# Altium project Vreg_Learning_Platform_Version1.0.PrjPcb (part 2 of 6)

## Sheet Input.SchDoc: <Project Name>
size A3; ApprovedBy: <Appr.>; Author: <Author>; CompanyName: Infineon Technologies AG; Engineer: <Rel.>; Organization: Infineon Technologies AG; Address1: IFAG DES S PS; Address2: Am Campeon 1-12  -  85579 Neubiberg  -  Germany; Address3: 85579 Neubiberg; Address4: Germany; DocumentNumber: 3; Revision: <Rev.>; SheetNumber: 3; SheetTotal: 9; Release: RC00; PageSetup: Record=PageOptions|CenterHorizontal=True|CenterVertical=True|PrintScale=1.01|XCorrection=1.00|YCorrection=1.00|PrintKind=0|BorderSize=5000000|LeftOffset=0|BottomOffset=0|Orientation=2|PaperLength=1000|PaperWidth=1000|Scale=100|PaperSource=7|PrintQuality=-4|MediaType=1|DitherType=10|PaperKind=A3|PrintScaleMode=1; Doc_ConfidentialStatus: <Doc_ConfidentialStatus>; Doc_Preliminary: <Doc_Preliminary>
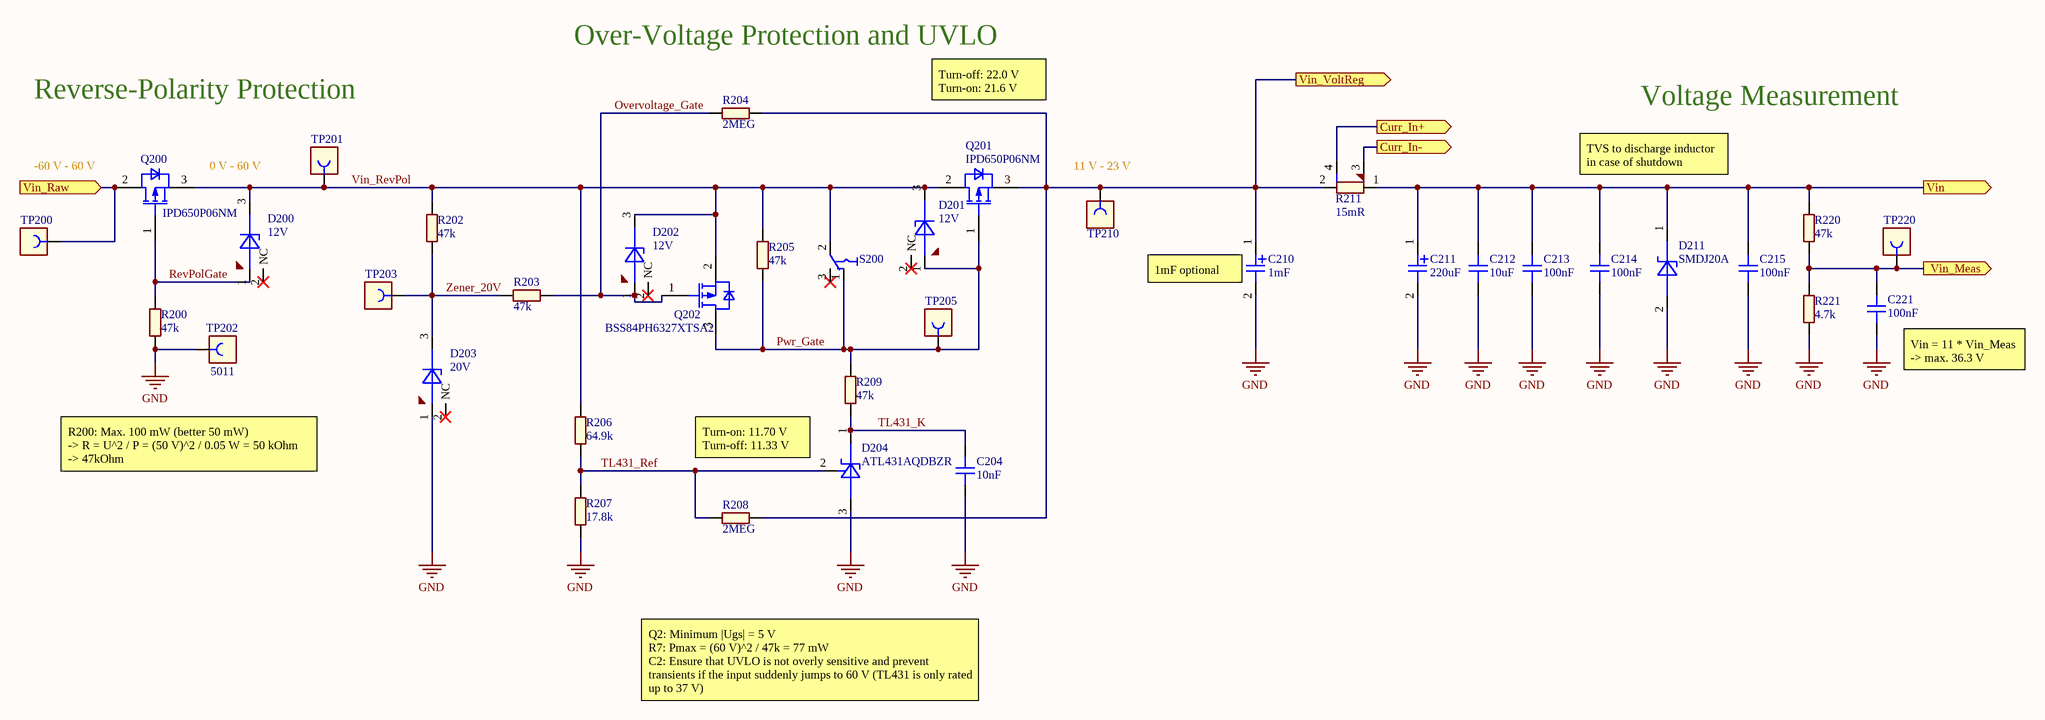
[diagram p1: Input.SchDoc]

### Parts
C204  10nF  [CAPC1608X90N-4]
C210  1mF  [CAPPRD500W60D1300H2700B]
C211  220uF  [CAPAE1030X1050N-2]
C212  10uF  [CAPC3216X190N-1]
C213  100nF  [CAPC1608X90N-2]
C214  100nF  [CAPC1608X90N-2]
C215  100nF  [CAPC1608X90N-2]
C221  100nF  [CAPC1608X90N-2]
D200  12V  [SOT95P237X111-3N-1]
D201  12V  [SOT95P237X111-3N-1]
D202  12V  [SOT95P237X111-3N-1]
D203  20V  [SOT95P237X111-3N-1]
D204  ATL431AQDBZR  [SOT95P237X112-3N-1]
D211  SMDJ20A  [DIOM7959X262N]
Q200  IPD650P06NM  [TO228P998X250-3N-V2]
Q201  IPD650P06NM  [TO228P998X250-3N-V2]
Q202  BSS84PH6327XTSA2  [SOT95P240X110-3N-1]
R200  47k  [RESC1609X50N]
R202  47k  [RESC1609X50N]
R203  47k  [RESC1609X50N]
R204  2MEG  [RESC1609X50N]
R205  47k  [RESC1609X50N]
R206  64.9k  [RESC1609X50N]
R207  17.8k  [RESC1609X50N]
R208  2MEG  [RESC1609X50N]
R209  47k  [RESC1609X50N]
R211  15mR  [RES-SMD-L4T12]
R220  47k  [RESC1609X50N]
R221  4.7k  [RESC1609X50N]
S200  CL-SB-12A-01T  [SW-SMD-CL-SB-12A-01T]  (value not drawn)
TP200  S1751-46R  [CON-SMD-TT-S1751-46]  (value not drawn)
TP201  S1751-46R  [CON-SMD-TT-S1751-46]  (value not drawn)
TP202  5011  [CON-THT-TP-5011]
TP203  S1751-46R  [CON-SMD-TT-S1751-46]  (value not drawn)
TP205  S1751-46R  [CON-SMD-TT-S1751-46]  (value not drawn)
TP210  S1751-46R  [CON-SMD-TT-S1751-46]  (value not drawn)
TP220  S1751-46R  [CON-SMD-TT-S1751-46]  (value not drawn)

### Ports
Curr_In+ (out), Curr_In- (out), Vin (out), Vin_Meas (out), Vin_Raw (in), Vin_VoltReg (out)

### Nets
GND: C204.1 C210.2 C211.2 C212.1 C213.1 C214.1 C215.1 C221.1 D203.1(ANODE) D204.3(ANODE) D211.2(ANODE) R200.1 R207.1 R221.1 TP202.1
Curr_In+: R211.4(I2) ; port Curr_In+
Curr_In-: R211.3(I1) ; port Curr_In-
Overvoltage_Gate: D202.1(ANODE) Q202.1(GATE) R203.1 R204.1
Pwr_Gate: D201.1(ANODE) Q201.1(GATE) Q202.3(DRAIN) R205.1 R209.2 S200.1 TP205.1
RevPolGate: D200.1(ANODE) Q200.1(GATE) R200.2
TL431_K: C204.2 D204.1(CATHODE) R209.1
TL431_Ref: D204.2(REF) R206.1 R207.2 R208.1
Vin: C211.1 C212.2 C213.2 C214.2 C215.2 D211.1(CATHODE) R211.1(V1) R220.1 ; port Vin
Vin_Meas: C221.2 R220.2 R221.2 TP220.1 ; port Vin_Meas
Vin_Raw: Q200.2(DRAIN) TP200.1 ; port Vin_Raw
Vin_RevPol: D200.3(CATHODE) D201.3(CATHODE) D202.3(CATHODE) Q200.3(SOURCE) Q201.2(DRAIN) Q202.2(SOURCE) R202.2 R205.2 R206.2 S200.2 TP201.1
Vin_VoltReg: C210.1 Q201.3(SOURCE) R204.2 R208.2 R211.2(V2) TP210.1 ; port Vin_VoltReg
Zener_20V: D203.3(CATHODE) R202.1 R203.2 TP203.1

Not connected (* = marked no-connect by the designer): D200 2(NC)*; D201 2(NC)*; D202 2(NC)*; D203 2(NC)*; S200 3*

### Notes on the sheet
- Over-Voltage Protection and UVLO
- Reverse-Polarity Protection
- Turn-off: 22.0 V
  Turn-on: 21.6 V
- Voltage Measurement
- (near Q200) -60 V - 60 V
- 0 V - 60 V
- (near TP210) 11 V - 23 V
- TVS to discharge inductor in case of shutdown
- (near C210) 1mF optional
- (near C221) Vin = 11 * Vin_Meas
  -> max. 36.3 V
- R200: Max. 100 mW (better 50 mW)
  -> R = U^2 / P = (50 V)^2 / 0.05 W = 50 kOhm
  -> 47kOhm
- Turn-on: 11.70 V
  Turn-off: 11.33 V
- Q2: Minimum |Ugs| = 5 V
  R7: Pmax = (60 V)^2 / 47k = 77 mW
  C2: Ensure that UVLO is not overly sensitive and prevent transients if the input suddenly jumps to 60 V (TL431 is only rated up to 37 V)
- Title
- Variant
- Approved
- Date:
- Author:
- Size:
- A3
- Document Name
- Time:
- SVN Revision:
- Rel.
- Rev.
- Sheet
- of

### Library data of the parts
C204 = 309974: CAP / CERA / 10nF / 50V / 10% / X8R (EIA) / -55°C to 150°C / 0603(1608) / SMD / -; Multiple Parts: No; Legacy PartNumber: CAP01010834; Manufacturer: TDK Corporation; Manufacturer Order Number: C1608X8R1H103K080AA; Symbol Type: Capacitor; Single; Standard; 2 Pins; Alternate View: Yes; Article Number: 309974; Version Number: V01; Combined Parameters: TC:X8R (EIA);Tol.:-10%/+10%;Vdc:50V; QuickPick: 10nF / 50V / 10% / X8R (EIA) / 0603 (1608); Type: Standard; Style: Single; Package Metric: 1608; Package Imperial: 0603; ComponentStatus: Released; PLMStatus: Active; Legacy DeviceID: CAP01010834; Part Type: Capacitor; Value: 10nF; Tolerance Neg: 10%; Tolerance Pos: 10%; Technology: Ceramic; Temperature min: -55; Temperature max: 150; Temperature Range: Military; ROHS Compliant: Y; Automotive Qualified: No; PackageReference: 0603 (1608); ComponentLink1Description: Vendor WebSite; ComponentLink1URL: http://www.tdk.com; ComponentLink2Description: Datasheet; ComponentLink2URL: http://webnetprod.muc.infineon.com/PCBPortal_Prod/WorkFlows/AltiumComponent/StandardDocumentation?Versionid=309975; Supplier 1: Farnell; Supplier Part Number 1: 1844454; Supplier 2: DigiKey; Supplier Part Number 2: 445-2504-2-ND; Supplier 3: Mouser; Supplier Part Number 3: 810-C1608X8R1H103K; Second Source allowed: Yes; Voltage DC (max): 50V; Package Description: Capacitor,non-polarized,Chip;1.60mm L X 0.80mm W X 0.90mm H
C210 = 646789: CAP / ELCO / 1mF / 35V / 20% / Aluminiumelectrolytic / -40°C to 105°C / 5.00mm C X 0.60mm W 13.00mm Dia X 27.00mm H / - / -; Multible Parts: No; Manufacturer: Kemet; Manufacturer Order Number: ESY108M035AL4AA; Symbol Type: Capacitor; Single; Polarized; 2 Pins; Pin 1 Positive; Alternate View: Yes; Article Number: 646789; Version Number: V01; Combined Parameters: TC:Aluminiumelectrolytic;Tol.:-20%/+20%;Vdc:35V; QuickPick: 1mF / 35V / 20% / Aluminiumelectrolytic / Radial; Type: Polarized; Style: Single; ComponentStatus: Released; PLMStatus: Active; Part Type: Capacitor; Value: 1mF; Tolerance Neg: 20%; Tolerance Pos: 20%; Application: Standard; Technology: Electrolytic; Temperature min: -40; Temperature max: 105; Temperature Range: Industrial; ROHS Compliant: Y; Automotive Qualified: No; PackageReference: Radial; ComponentLink1Description: Vendor WebSite; ComponentLink1URL: http://www.kemet.com; ComponentLink2Description: Datasheet; ComponentLink2URL: http://webnetprod.muc.infineon.com/PCBPortal_Prod/WorkFlows/AltiumComponent/StandardDocumentation?Versionid=646790; Supplier 1: Farnell; Supplier Part Number 1: 2835188; Supplier 2: DigiKey; Supplier Part Number 2: 399-6120-ND; Supplier 3: Mouser; Supplier Part Number 3: 80-ESY108M035AL4AA; Second Source allowed: Yes; Voltage DC (max): 35V; Package Description: Capacitor,polarized,Radial;5.00mm C X 0.60mm W 13.00mm Dia X 27.00mm H
C211 = 646791: CAP / ELCO / 220uF / 50V / 20% / Aluminiumelectrolytic / -55°C to 105°C / 10.30mm L X 10.30mm W X 10.50mm H / SMD / -; Multible Parts: No; Manufacturer: Wurth Elektronik; Manufacturer Order Number: 865080657018; Symbol Type: Capacitor; Single; Polarized; 2 Pins; Pin 1 Positive; Alternate View: Yes; Article Number: 646791; Version Number: V01; Combined Parameters: TC:Aluminiumelectrolytic;Tol.:-20%/+20%;Vdc:50V; QuickPick: 220uF / 50V / 20% / Aluminiumelectrolytic / SMD; Type: Polarized; Style: Single; ComponentStatus: Released; PLMStatus: Active; Part Type: Capacitor; Value: 220uF; Tolerance Neg: 20%; Tolerance Pos: 20%; Application: Standard; Technology: Electrolytic; Temperature min: -55; Temperature max: 105; Temperature Range: Military; ROHS Compliant: Y; Automotive Qualified: No; PackageReference: SMD; ComponentLink1Description: Vendor WebSite; ComponentLink1URL: http://www.we-online.com; ComponentLink2Description: Datasheet; ComponentLink2URL: http://webnetprod.muc.infineon.com/PCBPortal_Prod/WorkFlows/AltiumComponent/StandardDocumentation?Versionid=646792; Supplier 1: Farnell; Supplier Part Number 1: 2466345; Supplier 2: DigiKey; Supplier Part Number 2: 732-8463-1-ND; Supplier 3: Mouser; Supplier Part Number 3: 710-865080657018; Second Source allowed: Yes; Voltage DC (max): 50V; Package Description: Capacitor,Aluminum Electrolytic;10.30mm L X 10.30mm W X 10.50mm H
C212 = 648992: CAP / CERA / 10uF / 50V / 20% / X5R (EIA) / -55°C to 85°C / 1206 (3216) / SMD / -; Multiple Parts: No; Manufacturer: Taiyo Yuden; Manufacturer Order Number: UMK316BBJ106ML-T; Symbol Type: Capacitor; Single; Standard; 2 Pins; Alternate View: Yes; Article Number: 648992; Version Number: V00; Combined Parameters: TC:X5R (EIA);Tol.:-20%/+20%;Vdc:50V; QuickPick: 10uF / 50V / 20% / X5R (EIA) / 1206 (3216); Type: Standard; Style: Single; ComponentStatus: Released; PLMStatus: Active; Part Type: Capacitor; Value: 10uF; Tolerance Neg: 20%; Tolerance Pos: 20%; Application: Standard; Technology: Ceramic; Temperature min: -55; Temperature max: 85; Temperature Range: Military; ROHS Compliant: Y; Automotive Qualified: No; PackageReference: 1206 (3216); ComponentLink1Description: Vendor WebSite; ComponentLink1URL: http://www.yuden.co.jp/or/product/; ComponentLink2Description: Datasheet; ComponentLink2URL: http://webnetprod.muc.infineon.com/PCBPortal_Prod/WorkFlows/AltiumComponent/StandardDocumentation?Versionid=648993; Supplier 1: Farnell; Supplier Part Number 1: 2779059; Supplier 2: DigiKey; Supplier Part Number 2: 587-3248-1-ND; Supplier 3: Mouser; Supplier Part Number 3: 963-UMK316BBJ106ML-T; Second Source allowed: Yes; Voltage DC (max): 50V; Package Description: Capacitor,non-polarized,Chip;3.20mm L X 1.60mm W X 1.90mm H
C213-C215 C221 = 479045: CAP / CERA / 100nF / 50V / 10% / X7R (EIA) / -55°C to 125°C / 0603 / SMD / -; Multiple Parts: No; Manufacturer: AVX; Manufacturer Order Number: 06035C104KAT2A; Symbol Type: Capacitor; Single; Standard; 2 Pins; Alternate View: Yes; Article Number: 479045; Version Number: V01; Combined Parameters: TC:X7R (EIA);Tol.:-10%/+10%;Vdc:50V; QuickPick: 100nF / 50V / 10% / X7R (EIA) / 0603; Type: Standard; Style: Single; ComponentStatus: Released; PLMStatus: Active; Part Type: Capacitor; Value: 100nF; Tolerance Neg: 10%; Tolerance Pos: 10%; Application: Standard; Technology: Ceramic; Temperature min: -55; Temperature max: 125; Temperature Range: Military; ROHS Compliant: Y; Automotive Qualified: No; PackageReference: 0603; ComponentLink1Description: Vendor WebSite; ComponentLink1URL: http://www.avx.com; ComponentLink2Description: Datasheet; ComponentLink2URL: http://webnetprod.muc.infineon.com/PCBPortal_Prod/WorkFlows/AltiumComponent/StandardDocumentation?Versionid=479046; Supplier 1: Farnell; Supplier Part Number 1: 2280883; Supplier 2: DigiKey; Supplier Part Number 2: 478-5052-2-ND; Supplier 3: Mouser; Supplier Part Number 3: 581-06035C104KAT2A; Second Source allowed: Yes; Voltage DC (max): 50V; Package Description: Capacitor,non-polarized,Chip;1.60mm L X 0.81mm W X 0.90mm H
D200-D202 = 391041: Zener Voltage Regulator, 250 mW, 12V; Multiple Parts: No; Manufacturer: ON Semiconductor; Manufacturer Order Number: BZX84C12LT1G; Symbol Type: Standard Zener Diode, 3 Pins, 1 Anode, 2 Not Connected, 3 Cathode; Alternate View: Yes; Article Number: 391041; Version Number: V01; Combined Parameters: Vf:900mV;If:10mA;Ur:8V;Ir:100nA;Pmax:250mW; QuickPick: Zener Diode / SOT-23(TO-236); Type: Zener Diode; Style: Single; ComponentStatus: Released; PLMStatus: Active; Voltage DC (max): na; Part Type: Diode; Value: 12V; Application: Standard; Temperature min: -65; Temperature max: 150; Temperature Range: Military; ROHS Compliant: Y; Automotive Qualified: No; PackageReference: SOT-23(TO-236); ComponentLink1Description: Vendor WebSite; ComponentLink1URL: http://onsemi.com/; ComponentLink2Description: Datasheet; ComponentLink2URL: http://webnetprod.muc.infineon.com/PCBPortal_Prod/WorkFlows/AltiumComponent/StandardDocumentation?Versionid=391042; Supplier 1: Farnell; Supplier Part Number 1: 1459049; Supplier 2: DigiKey; Supplier Part Number 2: BZX84C12LT1GOSCT-ND; Supplier 3: Mouser; Supplier Part Number 3: 863-BZX84C12LT1G; Second Source allowed: Yes; Package Description: SOT,0.95mm pitch;3 pin,1.30mm W X 2.92mm L X 1.11mm H body
D203 = 391066: Zener Voltage Regulators; Multiple Parts: No; Manufacturer: ON Semiconductor; Manufacturer Order Number: BZX84C20LT1G; Symbol Type: Standard Zener Diode, 3 Pins, 1 Anode, 2 Not Connected, 3 Cathode; Alternate View: Yes; Article Number: 391066; Version Number: V01; Combined Parameters: Vf:900mV;If:10mA;Ur:14V;Ir:50nA;Pmax:250mW; QuickPick: Zener Diode / SOT-23; Type: Zener Diode; Style: Single; ComponentStatus: Released; PLMStatus: Active; Voltage DC (max): na; Part Type: Diode; Value: 20V; Application: Power Electronics; Temperature min: -65; Temperature max: 105; Temperature Range: Military; ROHS Compliant: Y; Automotive Qualified: No; PackageReference: SOT-23; ComponentLink1Description: Vendor WebSite; ComponentLink1URL: http://onsemi.com/; ComponentLink2Description: Datasheet; ComponentLink2URL: http://webnetprod.muc.infineon.com/PCBPortal_Prod/WorkFlows/AltiumComponent/StandardDocumentation?Versionid=391067; Supplier 1: Farnell; Supplier Part Number 1: 2463492; Supplier 2: DigiKey; Supplier Part Number 2: BZX84C20LT1GOSCT-ND; Supplier 3: Mouser; Supplier Part Number 3: 863-BZX84C20LT1G; Second Source allowed: Yes; Package Description: SOT,0.95mm pitch;3 pin,1.30mm W X 2.92mm L X 1.11mm H body
D204 = 644060: ATL431 Adjustable Precision Shunt Regulator; Manufacturer: Texas Instruments; Symbol type: TVS Diode Symbol, 1 Cathode, 2 Reference , 3 Anode; Article Number: 644060; Version Number: V01; Legacy DeviceID: TI_ATL431AQDBZR; Combined Parameters: - -;Vdc min/max:-;Iout:-;Fmax:-; QuickPick: SOT23-3 (DBZ); Automotive Qualified: No; ComponentStatus: Released; PLMStatus: Active; Second Source allowed: Yes; Voltage DC (max): na; Part Type: Integrated Circuit; Manufacturer Order Number: ATL431AQDBZR; Value: ATL431AQDBZR; Temperature min: -40; Temperature max: 125; Temperature Range: Automotive; ROHS Compliant: Y; PackageReference: SOT23-3 (DBZ); ComponentLink1Description: Vendor WebSite; ComponentLink1URL: http://www.ti.com; ComponentLink2Description: Datasheet; ComponentLink2URL: http://webnetprod.muc.infineon.com/PCBPortal_Prod/WorkFlows/AltiumComponent/StandardDocumentation?Versionid=644061; Supplier 1: Farnell; Supplier 2: DigiKey; Supplier Part Number 2: 296-47201-1-ND; Supplier 3: Mouser; Supplier Part Number 3: 595-ATL431AQDBZR; Package Description: SOT,0.95mm pitch;3 pin,1.30mm W X 2.92mm L X 1.12mm H body
D211 = 646382: TVS Diode, Low Profile Package, Built in Strain Relief, Glass Passivated Chip Junction; Manufacturer: Littelfuse; Symbol Type: Transient Voltage Suppressor Diode (TVS, TAZ), 1 Cathode, 2 Anode; Article Number: 646382; Version Number: V01; Combined Parameters: Vf:5V;If:-;Ur:20V;Ir:2uA;Pmax:6.5W; QuickPick: TVS Diode / DO-214AB; Style: Single; Automotive Qualified: No; ComponentStatus: Released; PLMStatus: Active; Second Source allowed: Yes; Voltage DC (max): na; Part Type: Diode; Manufacturer Order Number: SMDJ20A; Value: SMDJ20A; Type: TVS Diode; Application: Standard; Temperature min: -65; Temperature max: 150; Temperature Range: Military; ROHS Compliant: Y; PackageReference: DO-214AB; ComponentLink1Description: Vendor WebSite; ComponentLink1URL: http://www.littelfuse.com/; ComponentLink2Description: Datasheet; ComponentLink2URL: http://webnetprod.muc.infineon.com/PCBPortal_Prod/WorkFlows/AltiumComponent/StandardDocumentation?Versionid=646383; Supplier 1: Farnell; Supplier Part Number 1: 2777300; Supplier 2: DigiKey; Supplier Part Number 2: SMDJ20ACT-ND; Supplier 3: Mouser; Supplier Part Number 3: 576-SMDJ20A; Package Description: Diode,Molded Body;7.94mm L X 5.905mm W X 2.62mm H
Q200 Q201 = 644075: OptiMOS Power Transistor, -60 V; Manufacturer: Infineon Technologies; Symbol Type: Insulated-Gate Field-Effect Transistor (IGFET), P-Channel, Enhancement,  Body Diode, Pin 1 Gate, 2 Drain, 3 Source, 3 Pins; Article Number: 644075; Version Number: V01; Legacy DeviceID: IFX_IPD650P06NM; Combined Parameters: P-Channel Enhancement;Uds:-60V;Id:-22A;Rds:65R;P:83W; QuickPick: P-Channel Enhancement / 83W / -22A / -60V / PG-TO252-3-313; Type: P-Channel Enhancement; Style: Single; Automotive Qualified: No; ComponentStatus: Released; PLMStatus: Active; Second Source allowed: Yes; Voltage DC (max): na; Part Type: Transistor FET; Manufacturer Order Number: IPD650P06NM; Value: IPD650P06NM; Application: Power Electronics; Temperature min: -55; Temperature max: 175; Temperature Range: Military; ROHS Compliant: Y; PackageReference: PG-TO252-3-313; ComponentLink1Description: Vendor WebSite; ComponentLink1URL: https://www.infineon.com/; ComponentLink2Description: Datasheet; ComponentLink2URL: http://webnetprod.muc.infineon.com/PCBPortal_Prod/WorkFlows/AltiumComponent/StandardDocumentation?Versionid=644076; Supplier 1: Farnell; Supplier Part Number 1: 3267848; Supplier 2: DigiKey; Supplier Part Number 2: 448-IPD650P06NMATMA1CT-ND; Supplier 3: Mouser; Supplier Part Number 3: 726-IPD650P06NMATMA1; Package Description: TO,2.28mm pitch;2 pin,9.98mm L X 6.50mm W X 2.50mm H body
Q202 = 422992: SIPMOS P-Channel Enhancement Small-Signal-Transistor; Legacy PartNumber: IFX01400461; Manufacturer: Infineon Technologies; Symbol Type: Insulated-Gate Field-Effect Transistor (IGFET), P-Channel, Enhancement,  Body Diode, Pin 1 Gate, 2 Source, 3 Drain, 3 Pins; Article Number: 422992; Version Number: V01; Legacy DeviceID: IFX_BSS84PH6327XTSA2; Combined Parameters: P-Channel;Uds:-60V;Id:-170mA;Rds:12R;P:360mW; QuickPick: P-Channel / 360mW / -170mA / -60V / PG-SOT23; Style: Single; Automotive Qualified: AEC Q101; ComponentStatus: Released; PLMStatus: Active; Second Source allowed: Yes; Voltage DC (max): na; Part Type: Transistor FET; Manufacturer Order Number: BSS84PH6327XTSA2; Value: BSS84PH6327XTSA2; Type: P-Channel; Application: Power Supply; Temperature min: -55; Temperature max: 150; Temperature Range: Military; ROHS Compliant: Y; PackageReference: PG-SOT23; ComponentLink1Description: Vendor WebSite; ComponentLink1URL: https://www.infineon.com/; ComponentLink2Description: Datasheet; ComponentLink2URL: http://webnetprod.muc.infineon.com/PCBPortal_Prod/WorkFlows/AltiumComponent/StandardDocumentation?Versionid=422993; Supplier 1: Farnell; Supplier Part Number 1: 1056526; Supplier 2: DigiKey; Supplier Part Number 2: BSS84PH6327XTSA2TR-ND; Supplier 3: Mouser; Supplier Part Number 3: 726-BSS84PH6327XTSA2; Package Description: SOT23, 3-Leads, Body 2.90x2.40mm, Pitch 0.95mm, IPC Medium Density
R200 R202 R203 R205 R209 R220 = 346552: RES / STD / 47k / 100mW / 1% / 100ppm/K / -55°C to 155°C / 0603 / SMD / -; Multiple Parts: No; Legacy PartNumber: RES01801333; Manufacturer: Vishay; Manufacturer Order Number: CRCW060347K0FK; Symbol Type: Resistor; Single; Standard; 2 Pins; Alternate View: Yes; Article Number: 346552; Version Number: V01; Combined Parameters: TCR:100ppm/K;Tol.:-1%/+1%;Vdc:75V;Idc:-;P:100mW; QuickPick: 47k / 1% / 0.1 / 0603; Style: Single; Automotive Qualified: AEC Q200; ComponentStatus: Released; PLMStatus: Active; Voltage DC (max): 75V; Legacy DeviceID: RES01801333; Part Type: Resistor; Value: 47k; Tolerance Neg: 1%; Tolerance Pos: 1%; Type: Standard; Technology: Thick Film; Temperature min: -55; Temperature max: 155; Temperature Range: Military; ROHS Compliant: Y; PackageReference: 0603; ComponentLink1Description: Vendor WebSite; ComponentLink1URL: http://www.vishay.com; ComponentLink2Description: Datasheet; ComponentLink2URL: http://webnetprod.muc.infineon.com/PCBPortal_Prod/WorkFlows/AltiumComponent/StandardDocumentation?Versionid=346553; Supplier 1: Farnell; Supplier 2: DigiKey; Supplier Part Number 2: 541-47.0KHCT-ND; Supplier 3: Mouser; Second Source allowed: Yes
R204 R208 = 347472: RES / STD / 2MEG / 100mW / 1% / 100ppm/K / -55°C to 155°C / 0603 / SMD / -; Multiple Parts: No; Legacy PartNumber: RES01801517; Manufacturer: Vishay; Manufacturer Order Number: CRCW06032M00FK; Symbol Type: Resistor; Single; Standard; 2 Pins; Alternate View: Yes; Article Number: 347472; Version Number: V01; Combined Parameters: TCR:100ppm/K;Tol.:-1%/+1%;Vdc:75V;Idc:-;P:100mW; QuickPick: 2MEG / 1% / 0.1 / 0603; Style: Single; Automotive Qualified: AEC Q200; ComponentStatus: Released; PLMStatus: Active; Voltage DC (max): 75V; Legacy DeviceID: RES01801517; Part Type: Resistor; Value: 2MEG; Tolerance Neg: 1%; Tolerance Pos: 1%; Type: Standard; Technology: Thick Film; Temperature min: -55; Temperature max: 155; Temperature Range: Military; ROHS Compliant: Y; PackageReference: 0603; ComponentLink1Description: Vendor WebSite; ComponentLink1URL: http://www.vishay.com; ComponentLink2Description: Datasheet; ComponentLink2URL: http://webnetprod.muc.infineon.com/PCBPortal_Prod/WorkFlows/AltiumComponent/StandardDocumentation?Versionid=347473; Supplier 1: Farnell; Supplier 2: DigiKey; Supplier 3: Mouser; Second Source allowed: Yes
R206 = 346637: RES / STD / 64.9k / 100mW / 1% / 100ppm/K / -55°C to 155°C / 0603 / SMD / -; Multiple Parts: No; Legacy PartNumber: RES01801350; Manufacturer: Vishay; Manufacturer Order Number: CRCW060364K9FK; Symbol Type: Resistor; Single; Standard; 2 Pins; Alternate View: Yes; Article Number: 346637; Version Number: V01; Combined Parameters: TCR:100ppm/K;Tol.:-1%/+1%;Vdc:75V;Idc:-;P:100mW; QuickPick: 64.9k / 1% / 0.1 / 0603; Style: Single; Automotive Qualified: AEC Q200; ComponentStatus: Released; PLMStatus: Active; Voltage DC (max): 75V; Legacy DeviceID: RES01801350; Part Type: Resistor; Value: 64.9k; Tolerance Neg: 1%; Tolerance Pos: 1%; Type: Standard; Technology: Thick Film; Temperature min: -55; Temperature max: 155; Temperature Range: Military; ROHS Compliant: Y; PackageReference: 0603; ComponentLink1Description: Vendor WebSite; ComponentLink1URL: http://www.vishay.com; ComponentLink2Description: Datasheet; ComponentLink2URL: http://webnetprod.muc.infineon.com/PCBPortal_Prod/WorkFlows/AltiumComponent/StandardDocumentation?Versionid=346638; Supplier 1: Farnell; Supplier 2: DigiKey; Supplier 3: Mouser; Second Source allowed: Yes
R207 = 346302: RES / STD / 17.8k / 100mW / 1% / 100ppm/K / -55°C to 155°C / 0603 / SMD / -; Multiple Parts: No; Legacy PartNumber: RES01801283; Manufacturer: Vishay; Manufacturer Order Number: CRCW060317K8FK; Symbol Type: Resistor; Single; Standard; 2 Pins; Alternate View: Yes; Article Number: 346302; Version Number: V01; Combined Parameters: TCR:100ppm/K;Tol.:-1%/+1%;Vdc:75V;Idc:-;P:100mW; QuickPick: 17.8k / 1% / 0.1 / 0603; Style: Single; Automotive Qualified: AEC Q200; ComponentStatus: Released; PLMStatus: Active; Voltage DC (max): 75V; Legacy DeviceID: RES01801283; Part Type: Resistor; Value: 17.8k; Tolerance Neg: 1%; Tolerance Pos: 1%; Type: Standard; Technology: Thick Film; Temperature min: -55; Temperature max: 155; Temperature Range: Military; ROHS Compliant: Y; PackageReference: 0603; ComponentLink1Description: Vendor WebSite; ComponentLink1URL: http://www.vishay.com; ComponentLink2Description: Datasheet; ComponentLink2URL: http://webnetprod.muc.infineon.com/PCBPortal_Prod/WorkFlows/AltiumComponent/StandardDocumentation?Versionid=346303; Supplier 1: Farnell; Supplier 2: DigiKey; Supplier 3: Mouser; Second Source allowed: Yes
R211 = 644055: RES / STD / 15mR / 500mW / 1% / 75ppm/K / -55°C to 155°C / 1206 (3216) / SMD / -; Multiple Parts: No; Manufacturer: Ohmite; Manufacturer Order Number: L4T12FR015FER; Symbol Type: Resistor; 4-Terminal (Shunt); Standard; 4 Pins; Alternate View: Yes; Article Number: 644055; Version Number: V01; Combined Parameters: TCR:75ppm/K;Tol.:-1%/+1%;Vdc:-;Idc:-;P:500mW; QuickPick: 15mR / 1% / 0.5 / 1206 (3216); Style: 4-Terminal (Shunt); ComponentStatus: Released; PLMStatus: Active; Part Type: Resistor; Value: 15mR; Tolerance Neg: 1%; Tolerance Pos: 1%; Type: Standard; Application: Precision; Technology: Thick Film; Temperature min: -55; Temperature max: 155; Temperature Range: Military; ROHS Compliant: Y; Automotive Qualified: No; PackageReference: 1206 (3216); ComponentLink1Description: Vendor WebSite; ComponentLink1URL: http://www.ohmite.com; ComponentLink2Description: Datasheet; ComponentLink2URL: http://webnetprod.muc.infineon.com/PCBPortal_Prod/WorkFlows/AltiumComponent/StandardDocumentation?Versionid=644056; Supplier 1: Farnell; Supplier Part Number 1: 3274221; Supplier 2: DigiKey; Supplier Part Number 2: 273-L4T12FR015FERCT-ND; Supplier 3: Mouser; Supplier Part Number 3: 284-L4T12FR015FER; Second Source allowed: Yes; Package Description: Resistor, SMD, 4 pin, 3.00 mm L X 1.60 mm W X 0.65 mm H body
R221 = 345982: RES / STD / 4.7k / 100mW / 1% / 100ppm/K / -55°C to 155°C / 0603 / SMD / -; Multiple Parts: No; Legacy PartNumber: RES01801219; Manufacturer: Vishay; Manufacturer Order Number: CRCW06034K70FK; Symbol Type: Resistor; Single; Standard; 2 Pins; Alternate View: Yes; Article Number: 345982; Version Number: V01; Combined Parameters: TCR:100ppm/K;Tol.:-1%/+1%;Vdc:75V;Idc:-;P:100mW; QuickPick: 4.7k / 1% / 0.1 / 0603; Style: Single; Automotive Qualified: AEC Q200; ComponentStatus: Released; PLMStatus: Active; Voltage DC (max): 75V; Legacy DeviceID: RES01801219; Part Type: Resistor; Value: 4.7k; Tolerance Neg: 1%; Tolerance Pos: 1%; Type: Standard; Technology: Thick Film; Temperature min: -55; Temperature max: 155; Temperature Range: Military; ROHS Compliant: Y; PackageReference: 0603; ComponentLink1Description: Vendor WebSite; ComponentLink1URL: http://www.vishay.com; ComponentLink2Description: Datasheet; ComponentLink2URL: http://webnetprod.muc.infineon.com/PCBPortal_Prod/WorkFlows/AltiumComponent/StandardDocumentation?Versionid=345983; Supplier 1: Farnell; Supplier 2: DigiKey; Supplier 3: Mouser; Second Source allowed: Yes
S200 = 650099: Slid Switch, 12V, 200mA; Manufacturer: NIDEC COPAL ELECTRONICS, Inc.; Symbol Type: Switch, 2 Change Over 1 3, 3 Pins; Article Number: 650099; Version Number: V00; Automotive Qualified: No; ComponentStatus: Released; PLMStatus: Active; Second Source allowed: Yes; Voltage DC (max): na; Part Type: Electro Mechanic; Manufacturer Order Number: CL-SB-12A-01T; Value: CL-SB-12A-01T; Application: Power; Temperature min: -40; Temperature max: 85; Temperature Range: Industrial; ROHS Compliant: Y; ComponentLink1Description: Vendor WebSite; ComponentLink1URL: www.copal-electronics.com/; ComponentLink2Description: Datasheet; ComponentLink2URL: http://webnetprod.muc.infineon.com/PCBPortal_Prod/WorkFlows/AltiumComponent/StandardDocumentation?Versionid=650100; Supplier 1: Farnell; Supplier Part Number 1: 2854744; Supplier 2: DigiKey; Supplier Part Number 2: 563-1314-1-ND; Supplier 3: Mouser; Supplier Part Number 3: 229-CL-SB-12A-01T; Package Description: Switch, SMD, 3 Pins, 3.50 mm W X 8.50 mm L X 6.10 mm H body
TP200 TP201 TP203 TP205 TP210 TP220 = 387486: Test Terminal, Surface Mount (Tape and Reeled Components); Multiple Parts: No; Legacy PartNumber: CON01501015; Manufacturer: Harwin; Symbol Type: Connector, 1 Lead, Female; Alternate View: Yes; Article Number: 387486; Version Number: V01; Legacy DeviceID: HAR_S1751-46R; Combined Parameters: Board-to-Cable None (onboard);1x1;Mounting:SMT;Orient:None (onboard);Shielded:No; QuickPick: None (onboard) / Board-to-Cable; Style: Not Applicable; ComponentStatus: Released; PLMStatus: Active; Voltage DC (max): na; Part Type: Connector; Manufacturer Order Number: S1751-46R; Value: S1751-46R; Type: Board-to-Cable; Application: Test; Temperature min: 0; Temperature max: 0; Temperature Range: Military; ROHS Compliant: Y; Automotive Qualified: No; ComponentLink1Description: Vendor WebSite; ComponentLink1URL: http://www.harwin.com/; ComponentLink2Description: Datasheet; ComponentLink2URL: http://webnetprod.muc.infineon.com/PCBPortal_Prod/WorkFlows/AltiumComponent/StandardDocumentation?Versionid=387487; Supplier 1: Farnell; Supplier Part Number 1: 2411184; Supplier 2: DigiKey; Supplier Part Number 2: 952-1478-2-ND; Supplier 3: Mouser; Supplier Part Number 3: 855-S1751-46R; Second Source allowed: Yes; Package Description: Test Terminal, SMD, 3.25mm L X 1.65mm W X 2.15mm H body
TP202 = 382410: PC Test Point-Multipurpose THT, Black; Multiple Parts: No; Legacy PartNumber: CON01500530; Manufacturer: Keystone Electronics Corp.; Symbol Type: Connector, 1 Lead, Female; Alternate View: Yes; Article Number: 382410; Version Number: V01; Legacy DeviceID: KEY_5011; Combined Parameters: Board-to-Cable None (onboard);1x1;Mounting:THT;Orient:0° (vertical);Shielded:No; QuickPick: 0° (vertical) / Board-to-Cable; Style: Not Applicable; ComponentStatus: Released; PLMStatus: Active; Voltage DC (max): na; Part Type: Connector; Manufacturer Order Number: 5011; Value: 5011; Type: Board-to-Cable; Application: Test; Temperature min: 0; Temperature max: 0; Temperature Range: Military; ROHS Compliant: Y; Automotive Qualified: No; ComponentLink1Description: Vendor WebSite; ComponentLink1URL: http://www.keyelco.com/; ComponentLink2Description: Datasheet; ComponentLink2URL: http://webnetprod.muc.infineon.com/PCBPortal_Prod/WorkFlows/AltiumComponent/StandardDocumentation?Versionid=382411; Supplier 1: Farnell; Supplier Part Number 1: 2431148; Supplier 2: DigiKey; Supplier Part Number 2: 36-5011-ND; Supplier 3: Mouser; Supplier Part Number 3: 534-5011; Second Source allowed: Yes; Package Description: Test Point, 1.78 mm Lead Width, Round, 3.17 mm Dia X 8.28 mm H body